# EAGLE board Simple_Motherboard (EAGLE 6.5.0)
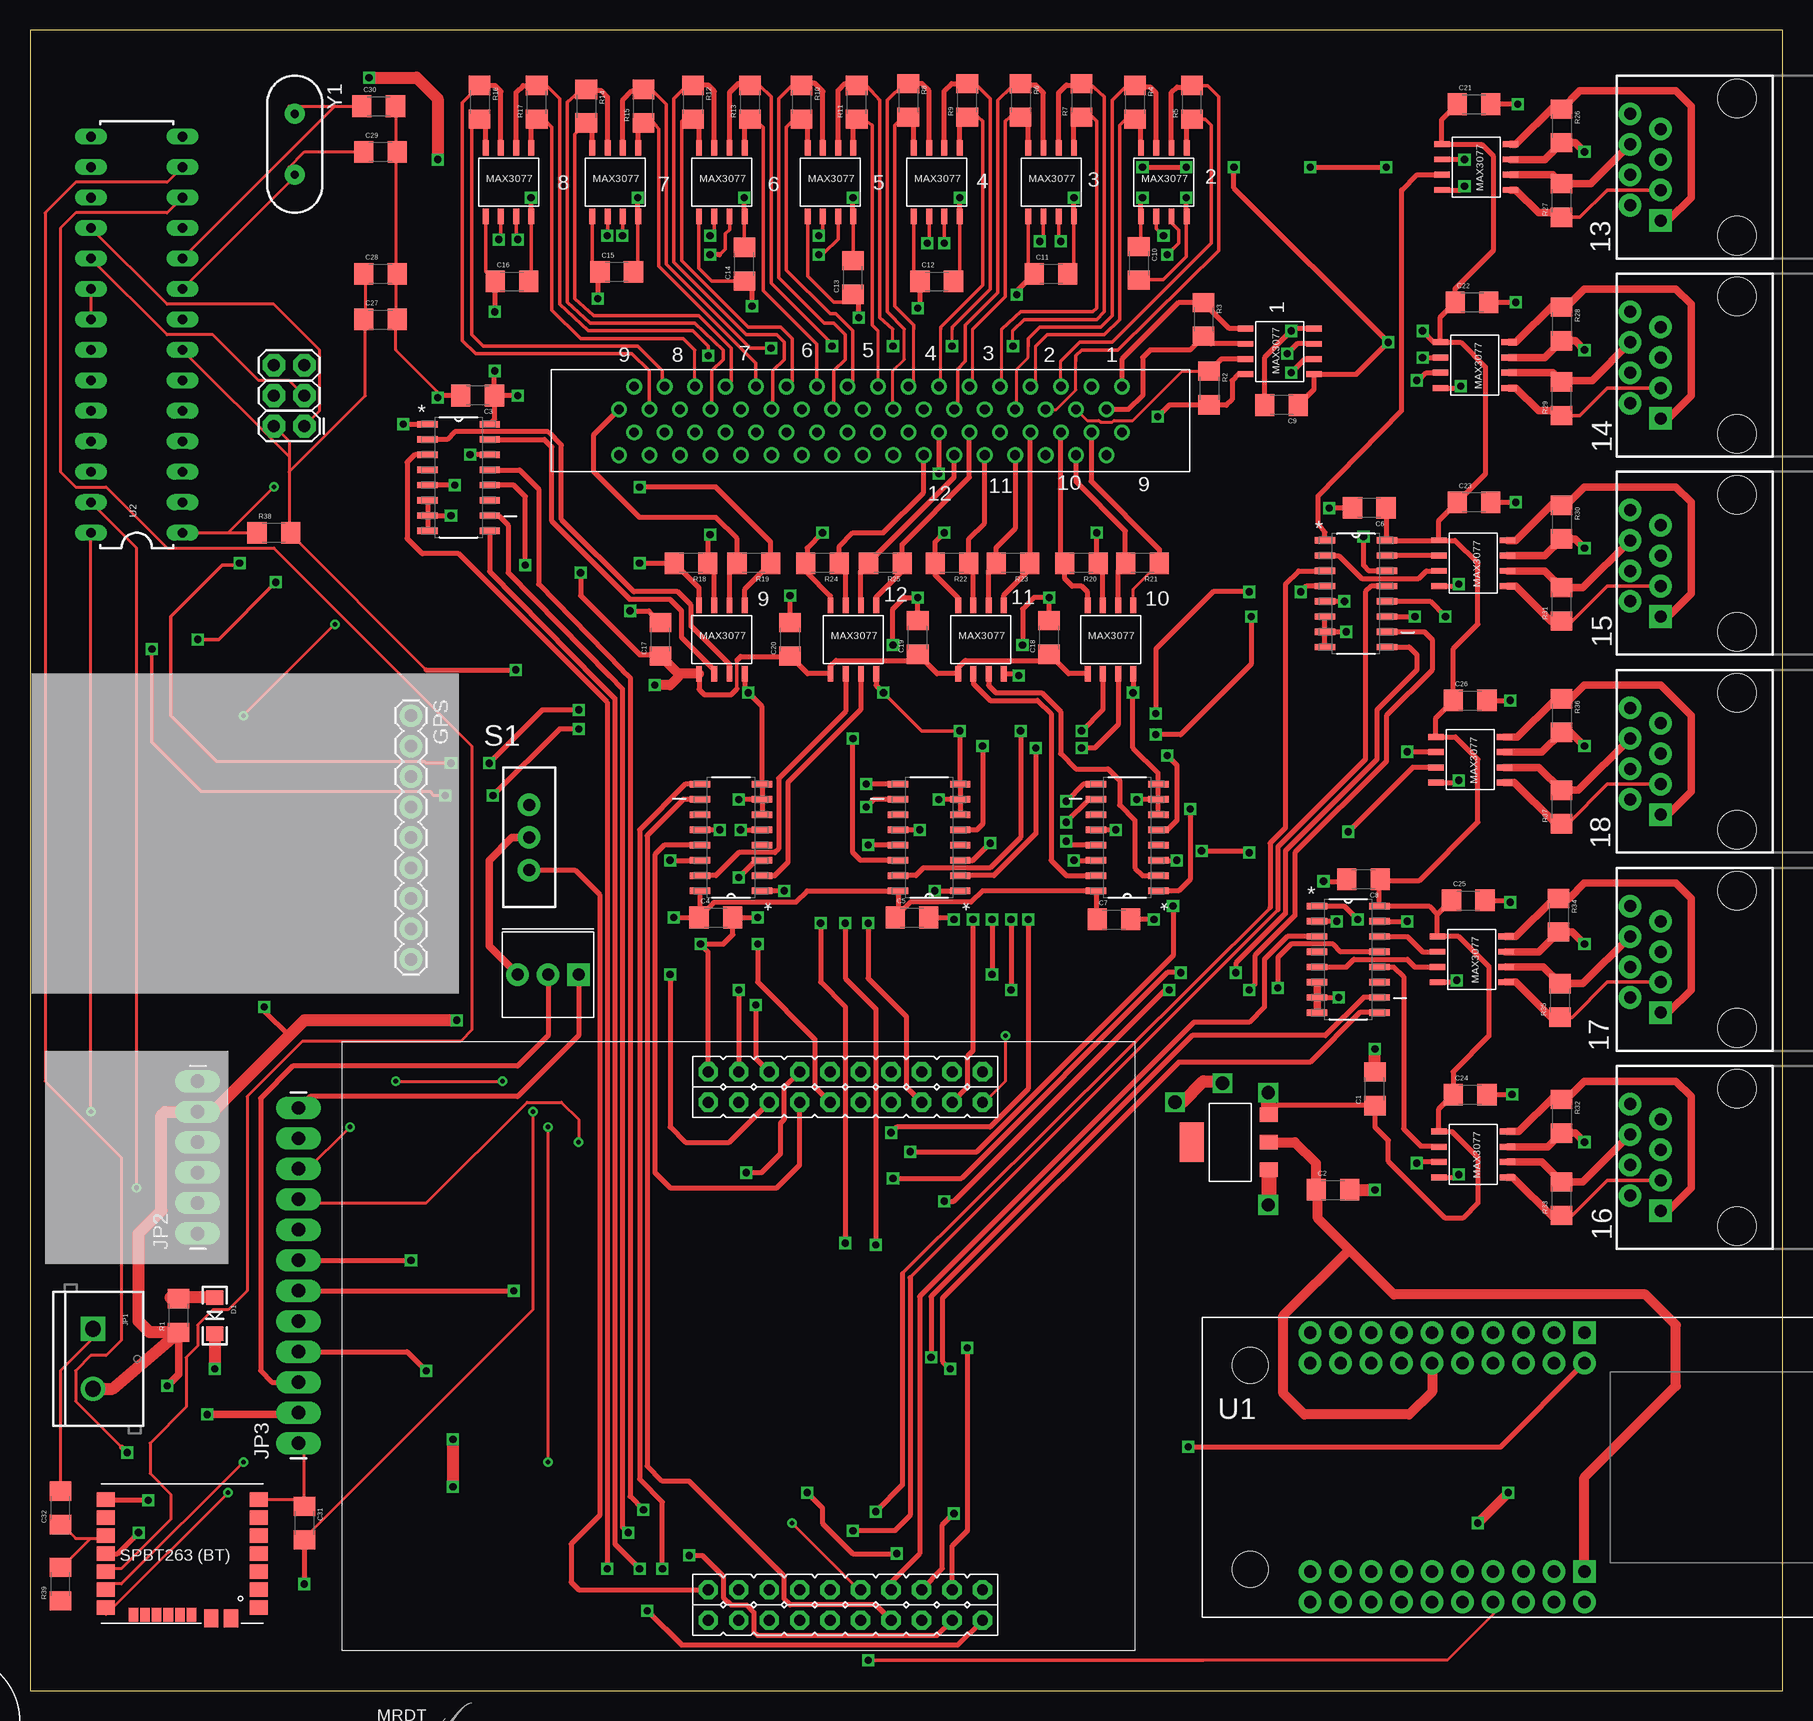
[diagram p7: board, top side]
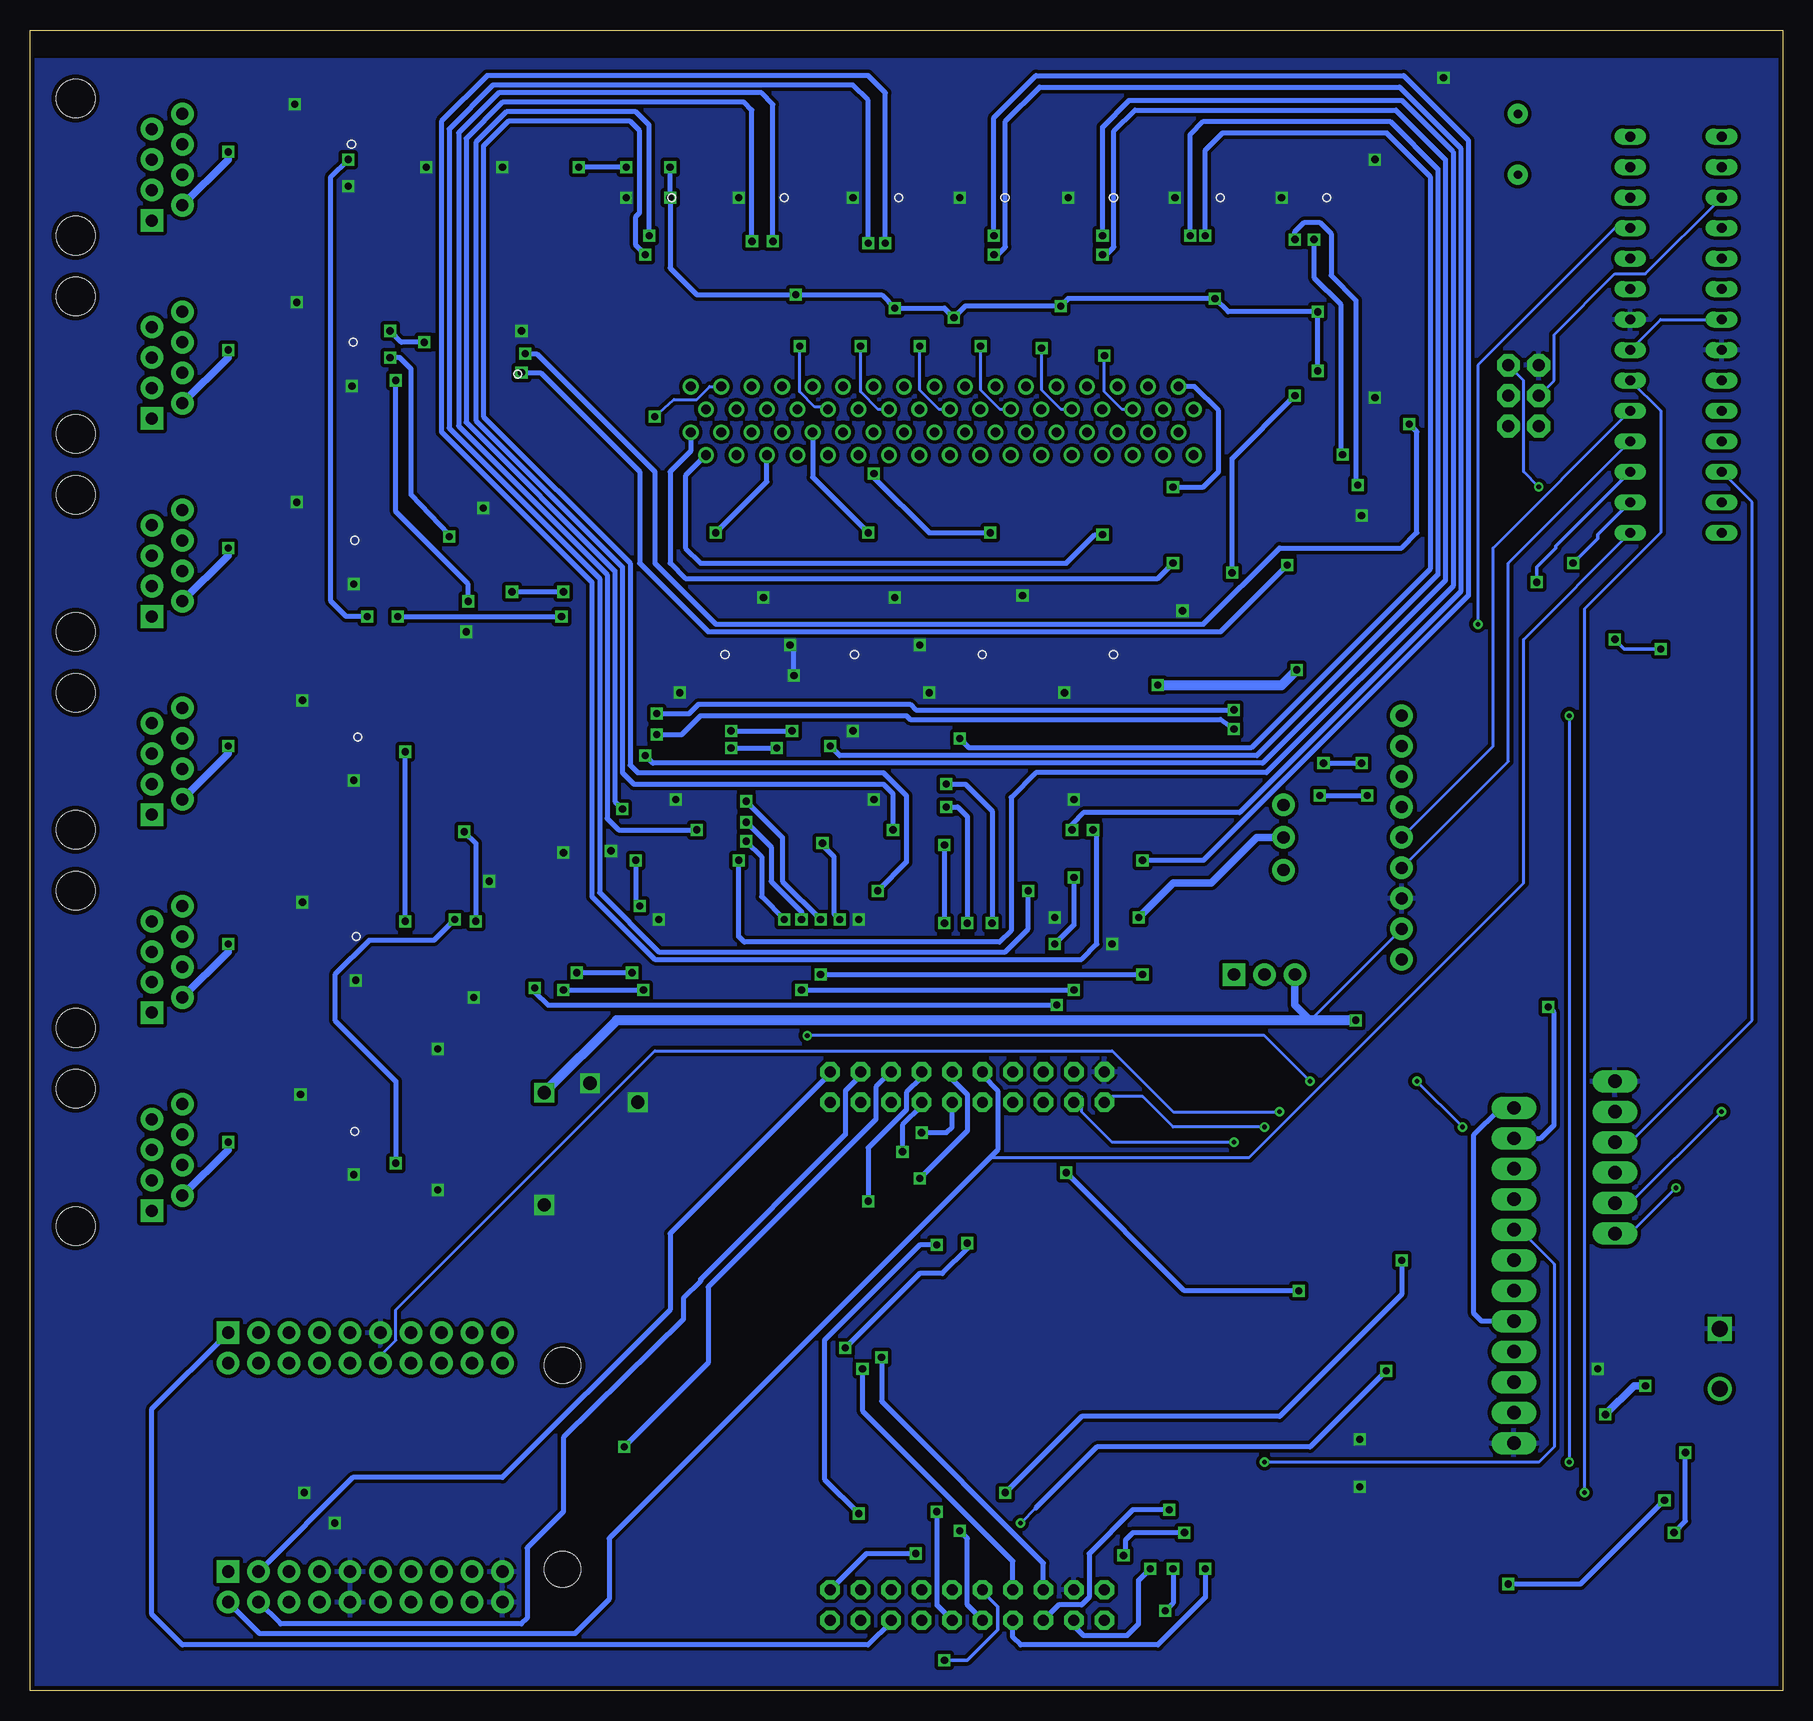
[diagram p8: board, bottom side, seen from below]

Size 146.05 x 138.43 mm. Coordinates in mm from the lower left corner, seen from the top.
Outline: 0,0 146.05,0 146.05,138.43 0,138.43 0,0
Copper layers (1*16): Top 0.035559375mm / dielectric 1.501140625mm / Bottom 0.035559375mm
Design rules "default *": minimum track width 10mil, minimum drill 15mil, track to track 8mil, track to pad 6mil, pad to pad 6mil, via to via 6mil, smd to smd 6mil, copper to edge 15mil, drill to drill 8mil, minimum pad ring 10mil, minimum via ring 8mil, stop-mask expansion 4mil, vias tented up to drill 0mil, thermal gap 10mil
tRestrict: area 26.4,21.6 to 33.8,21.6

## Footprints (pad centres in the part's own frame; a part is rotated, then mirrored left to right if it is on the bottom)
SPBT2632C2A = smd 1.2 x 1.5: BOOT 3,6.37; CTS 0,6.37; GND 4.5,-6.37; GPIO1 -4.5,-6.37; GPIO2 -3,-6.37; GPIO3 -1.5,-6.37; GPIO4 0,-6.37; GPIO5 1.5,-6.37; GPIO6 3,-6.37; RESET 1.5,6.37; RTS -1.5,6.37; RXD -3,6.37; TXD -4.5,6.37; VIN 4.5,6.37 | smd 1.5 x 1.2: GPIO7 -5.4,-4.05; LPO -5.4,-2.4 | smd 1.2 x 0.8: NC -5.1,4.075; NC1 -5.1,3.11; NC2 -5.1,2.145; NC3 -5.1,1.18; NC4 -5.1,0.215; NC5 -5.1,-0.75
1206 = smd 1.6 x 1.8: 1 -1.4,0; 2 1.4,0
LED-1206 = smd 1.2 x 1.4: A -1.5,0; C 1.5,0
1X09 = drill 1.016 pad 1.88: 1 0,0; 2 2.54,0; 3 5.08,0; 4 7.62,0; 5 10.16,0; 6 12.7,0; 7 15.24,0; 8 17.78,0; 9 20.32,0
H_MNTHOLE_#4 = drill 2.946: 1 0,0
2X3 = drill 1.016 pad 1.88 octagon: 1 0,0; 2 0,2.54; 3 2.54,0; 4 2.54,2.54; 5 5.08,0; 6 5.08,2.54
SCREWTERMINAL-5MM-2 = drill 1.3 pad 2.032 square: 1 0,0 | drill 1.3 pad 2.032: 2 5,0
1X06_LONGPADS = drill 1.118 pad 1.88 long: 1 0,0; 2 2.54,0; 3 5.08,0; 4 7.62,0; 5 10.16,0; 6 12.7,0
1X12_LONGPADS = drill 1.118 pad 1.88 long: 1 0,0; 2 2.54,0; 3 5.08,0; 4 7.62,0; 5 10.16,0; 6 12.7,0; 7 15.24,0; 8 17.78,0; 9 20.32,0; 10 22.86,0; 11 25.4,0; 12 27.94,0
MAX3070E = smd 0.49 x 1.3: A -1.905,2.857; B -0.635,2.857; DI 0.635,-2.857; GND 1.905,-2.857; RO -0.635,-2.857; VCC -1.905,-2.857; Y 1.905,2.857; Z 0.635,2.857
SWITCH-SPDT_LOCK.007S = drill 1.016 pad 1.88: 1 0,2.718; 2 0,0; 3 0,-2.718
WIZ811MJ = drill 1.02 pad 1.88 square: 1 0,0; 21 0,-19.92 | drill 1.02 pad 1.88: 2 0,-2.54; 3 -2.54,0; 4 -2.54,-2.54; 5 -5.08,0; 6 -5.08,-2.54; 7 -7.62,0; 8 -7.62,-2.54; 9 -10.16,0; 10 -10.16,-2.54; 11 -12.7,0; 12 -12.7,-2.54; 13 -15.24,0; 14 -15.24,-2.54; 15 -17.78,0; 16 -17.78,-2.54; 17 -20.32,0; 18 -20.32,-2.54; 19 -22.86,0; 20 -22.86,-2.54; 22 0,-22.46; 23 -2.54,-19.92; 24 -2.54,-22.46; 25 -5.08,-19.92; 26 -5.08,-22.46; 27 -7.62,-19.92; 28 -7.62,-22.46; 29 -10.16,-19.92; 30 -10.16,-22.46; 31 -12.7,-19.92; 32 -12.7,-22.46; 33 -15.24,-19.92; 34 -15.24,-22.46; 35 -17.78,-19.92; 36 -17.78,-22.46; 37 -20.32,-19.92; 38 -20.32,-22.46; 39 -22.86,-19.92; 40 -22.86,-22.46 | hole 3: -27.86,-19.73; -27.86,-2.73
SOIC127P600X175-16N = smd 1.702 x 0.533: 1 -2.591,4.445; 2 -2.591,3.175; 3 -2.591,1.905; 4 -2.591,0.635; 5 -2.591,-0.635; 6 -2.591,-1.905; 7 -2.591,-3.175; 8 -2.591,-4.445; 9 2.591,-4.445; 10 2.591,-3.175; 11 2.591,-1.905; 12 2.591,-0.635; 13 2.591,0.635; 14 2.591,1.905; 15 2.591,3.175; 16 2.591,4.445
DIL28-3 = drill 0.813 long: 1 -16.51,-3.81; 2 -13.97,-3.81; 3 -11.43,-3.81; 4 -8.89,-3.81; 5 -6.35,-3.81; 6 -3.81,-3.81; 7 -1.27,-3.81; 8 1.27,-3.81; 9 3.81,-3.81; 10 6.35,-3.81; 11 8.89,-3.81; 12 11.43,-3.81; 13 13.97,-3.81; 14 16.51,-3.81; 15 16.51,3.81; 16 13.97,3.81; 17 11.43,3.81; 18 8.89,3.81; 19 6.35,3.81; 20 3.81,3.81; 21 1.27,3.81; 22 -1.27,3.81; 23 -3.81,3.81; 24 -6.35,3.81; 25 -8.89,3.81; 26 -11.43,3.81; 27 -13.97,3.81; 28 -16.51,3.81
LD1117SOT-223 = smd 3.3 x 2: (VOUT) 0,3.2 | smd 1.2 x 1.5: GND -2.3,-3.2; VIN 2.3,-3.2; VOUT 0,-3.2
LAUNCHPAD-XL = drill 0.914 pad 1.6 octagon: 3.3V 30.48,2.54; GND1 33.02,5.08; GND2 30.48,48.26; PA2 53.34,48.26; PA3 50.8,48.26; PA4 48.26,48.26; PA5 48.26,2.54; PA6 50.8,2.54; PA7 53.34,2.54; PB0 35.56,2.54; PB1 38.1,2.54; PB2 33.02,48.26; PB3 35.56,45.72; PB4 45.72,2.54; PB5 33.02,2.54; PB6 45.72,48.26; PB7 43.18,48.26; PC4 38.1,45.72; PC5 40.64,45.72; PC6 43.18,45.72; PC7 45.72,45.72; PD0 35.56,5.08; PD1 38.1,5.08; PD2 40.64,5.08; PD3 43.18,5.08; PD6 48.26,45.72; PD7 50.8,45.72; PE0 35.56,48.26; PE1 45.72,5.08; PE2 48.26,5.08; PE3 50.8,5.08; PE4 40.64,2.54; PE5 43.18,2.54; PF0 38.1,48.26; PF1 53.34,5.08; PF2 30.48,45.72; PF3 33.02,45.72; PF4 53.34,45.72; RST 40.64,48.26; VBUS 30.48,5.08
60050685100 = drill 0.8: 1 47.555,7.107; 2 46.285,5.202; 3 45.015,7.107; 4 43.745,5.202; 5 42.475,7.107; 6 41.205,5.202; 7 39.935,7.107; 8 38.665,5.202; 9 37.395,7.107; 10 36.125,5.202; 11 34.855,7.107; 12 33.585,5.202; 13 32.315,7.107; 14 31.045,5.202; 15 29.775,7.107; 16 28.505,5.202; 17 27.235,7.107; 18 25.965,5.202; 19 24.695,7.107; 20 23.425,5.202; 21 22.155,7.107; 22 20.885,5.202; 23 19.615,7.107; 24 18.345,5.202; 25 17.075,7.107; 26 15.805,5.202; 27 14.535,7.107; 28 13.265,5.202; 29 11.995,7.107; 30 10.725,5.202; 31 9.455,7.107; 32 8.185,5.202; 33 6.915,7.107; 34 5.645,5.202; 35 47.555,3.297; 36 46.285,1.393; 37 45.015,3.297; 38 43.745,1.393; 39 42.475,3.297; 40 41.205,1.393; 41 39.935,3.297; 42 38.665,1.393; 43 37.395,3.297; 44 36.125,1.393; 45 34.855,3.297; 46 33.585,1.393; 47 32.315,3.297; 48 31.045,1.393; 49 29.775,3.297; 50 28.505,1.393; 51 27.235,3.297; 52 25.965,1.393; 53 24.695,3.297; 54 23.425,1.393; 55 22.155,3.297; 56 20.885,1.393; 57 19.615,3.297; 58 18.345,1.393; 59 17.075,3.297; 60 15.805,1.393; 61 14.535,3.297; 62 13.265,1.393; 63 11.995,3.297; 64 10.725,1.393; 65 9.455,3.297; 66 8.185,1.393; 67 6.915,3.297; 68 5.645,1.393
RJ45-8 = drill 1 pad 1.88 square: 1 -4.445,6.35 | drill 1 pad 1.88: 2 -3.175,8.89; 3 -1.905,6.35; 4 -0.635,8.89; 5 0.635,6.35; 6 1.905,8.89; 7 3.175,6.35; 8 4.445,8.89 | hole 3.2: -5.715,0; 5.715,0
3362U = drill 1.016 pad 1.88 square: P$1 0,2.54 | drill 1.016 pad 1.88: P$2 2.54,2.54; P$3 5.08,2.54
HC49US = drill 0.7 pad 1.651: 1 -2.54,0; 2 2.54,0

## Placement (x,y rotation side)
BLUETOOTH  SPBT2632C2A  [SPBT2632C2A]  12.7,11.43 90 top
C1  100nF  [1206]  112.08,50.16 90 top
C2  10uF  [1206]  108.59,41.75 0 top
C3  0.1uF  [1206]  37.31,107.95 180 top
C4  0.1uF  [1206]  57.15,64.45 0 top
C5  0.1uF  [1206]  73.5,64.45 0 top
C6  0.1uF  [1206]  111.6,98.58 180 top
C7  0.1uF  [1206]  90.33,64.29 0 top
C8  0.1uF  [1206]  111.12,67.63 180 top
C9  0.1uF  [1206]  104.3,107.16 180 top
C10  0.1uF  [1206]  92.39,118.97 270 top
C11  0.1uF  [1206]  85.09,118.11 0 top
C12  0.1uF  [1206]  75.56,117.48 0 top
C13  0.1uF  [1206]  68.58,117.79 90 top
C14  0.1uF  [1206]  59.53,118.9 90 top
C15  0.1uF  [1206]  48.89,118.27 0 top
C16  0.1uF  [1206]  40.16,117.48 0 top
C17  0.1uF  [1206]  52.55,87.63 90 top
C18  0.1uF  [1206]  84.93,87.79 90 top
C19  0.1uF  [1206]  73.98,87.79 90 top
C20  0.1uF  [1206]  63.34,87.63 90 top
C21  0.1uF  [1206]  120.33,132.24 0 top
C22  0.1uF  [1206]  120.17,115.73 0 top
C23  0.1uF  [1206]  120.33,99.06 0 top
C24  0.1uF  [1206]  120.01,49.69 0 top
C25  0.1uF  [1206]  119.86,65.88 0 top
C26  0.1uF  [1206]  120.01,82.55 0 top
C27  0.1uF  [1206]  29.21,114.3 0 top
C28  0.1uF  [1206]  29.21,118.11 0 top
C29  22pF  [1206]  29.21,128.27 0 top
C30  22pF  [1206]  29.05,132.08 0 top
C31  0.1uF  [1206]  22.86,13.97 270 top
C32  0.1uF  [1206]  2.54,15.24 90 top
D1  GREEN  [LED-1206]  15.4,31.27 270 top
GPS  M09  [1X09]  31.75,81.28 270 top
H1  [H_MNTHOLE_#4]  -6.35,-2.54 0 top  (outside the outline)
H2  [H_MNTHOLE_#4]  -17.78,-2.54 0 top  (outside the outline)
H3  [H_MNTHOLE_#4]  -29.21,-2.54 0 top  (outside the outline)
H4  [H_MNTHOLE_#4]  -40.64,-2.54 0 top  (outside the outline)
J1  AVR_SPI_PRG_6PTH  [2X3]  22.86,105.41 90 top
JP1  M025MM  [SCREWTERMINAL-5MM-2]  5.24,30.16 270 top
JP2  [1X06_LONGPADS]  13.97,38.1 90 top
JP3  M12LONGPADS  [1X12_LONGPADS]  22.38,20.64 90 top
R1  330  [1206]  12.38,31.27 90 top
R2  120  [1206]  98.27,108.59 270 top
R3  120  [1206]  97.79,114.3 270 top
R4  120  [1206]  92.07,132.4 270 top
R5  120  [1206]  96.84,132.4 90 top
R6  120  [1206]  82.55,132.56 270 top
R7  120  [1206]  87.63,132.56 90 top
R8  120  [1206]  73.18,132.56 270 top
R9  120  [1206]  78.1,132.56 90 top
R10  120  [1206]  64.29,132.4 270 top
R11  120  [1206]  68.9,132.4 90 top
R12  120  [1206]  55.24,132.4 270 top
R13  120  [1206]  60.01,132.4 90 top
R14  120  [1206]  46.35,132.08 270 top
R15  120  [1206]  51.12,132.08 90 top
R16  120  [1206]  37.46,132.4 270 top
R17  120  [1206]  42.23,132.4 90 top
R18  120  [1206]  55.09,93.98 180 top
R19  120  [1206]  60.32,93.98 180 top
R20  120  [1206]  87.63,93.98 180 top
R21  120  [1206]  92.71,93.98 180 top
R22  120  [1206]  76.84,93.98 180 top
R23  120  [1206]  81.91,93.98 180 top
R24  120  [1206]  66.04,93.98 180 top
R25  120  [1206]  71.28,93.98 180 top
R26  120  [1206]  127.63,130.43 270 top
R27  120  [1206]  127.63,124.21 90 top
R28  120  [1206]  127.63,113.92 270 top
R29  120  [1206]  127.63,107.7 90 top
R30  120  [1206]  127.63,97.41 270 top
R31  120  [1206]  127.63,90.55 90 top
R32  120  [1206]  127.63,47.88 270 top
R33  120  [1206]  127.63,41.02 90 top
R34  120  [1206]  127.38,64.64 270 top
R35  120  [1206]  127.51,57.53 90 top
R36  120  [1206]  127.63,81.28 270 top
R37  120  [1206]  127.63,73.66 90 top
R38  10k  [1206]  20.32,96.52 0 top
R39  10k  [1206]  2.54,8.89 90 top
RS-485-1  MAX3077  [MAX3070E]  120.52,127 270 top
RS-485-2  MAX3077  [MAX3070E]  120.4,110.49 270 top
RS-485-3  MAX3077  [MAX3070E]  120.27,93.98 270 top
RS-485-4  MAX3077  [MAX3070E]  120.27,44.7 270 top
RS-485-5  MAX3077  [MAX3070E]  120.14,60.96 270 top
RS-485-6  MAX3077  [MAX3070E]  120.01,77.6 270 top
RS_TRANS_1  MAX3077  [MAX3070E]  104.14,111.63 90 top
RS_TRANS_2  MAX3077  [MAX3070E]  94.49,125.73 0 top
RS_TRANS_3  MAX3077  [MAX3070E]  85.09,125.73 0 top
RS_TRANS_4  MAX3077  [MAX3070E]  75.56,125.73 0 top
RS_TRANS_5  MAX3077  [MAX3070E]  66.71,125.73 0 top
RS_TRANS_6  MAX3077  [MAX3070E]  57.66,125.73 0 top
RS_TRANS_7  MAX3077  [MAX3070E]  48.77,125.73 0 top
RS_TRANS_8  MAX3077  [MAX3070E]  39.88,125.73 0 top
RS_TRANS_9  MAX3077  [MAX3070E]  57.66,87.63 0 top
RS_TRANS_10  MAX3077  [MAX3070E]  90.04,87.63 0 top
RS_TRANS_11  MAX3077  [MAX3070E]  79.25,87.63 0 top
RS_TRANS_12  MAX3077  [MAX3070E]  68.61,87.63 0 top
S1  [SWITCH-SPDT_LOCK.007S]  41.59,71.12 0 top
U1  WIZ811MJ  [WIZ811MJ]  129.54,29.84 0 top
U1_MUX  74HC4052D,653  [SOIC127P600X175-16N]  35.72,101.12 0 top
U2  ATMEGA328P_PDIP  [DIL28-3]  8.89,113.03 90 top
U2_MUX  74HC4052D,653  [SOIC127P600X175-16N]  74.93,71.12 180 top
U3_MUX  74HC4052D,653  [SOIC127P600X175-16N]  91.44,71.12 180 top
U4_MUX  74HC4052D,653  [SOIC127P600X175-16N]  58.42,71.12 180 top
U5_MUX  74HC4052D,653  [SOIC127P600X175-16N]  110.49,91.44 0 top
U7_MUX  74HC4052D,653  [SOIC127P600X175-16N]  109.85,60.96 0 top
U$1  LD1117  [LD1117SOT-223]  100.01,45.72 90 top
U$2  STELLARIS-LAUNCHPADSTELLARIS-LAUNCHPAD-XL  [LAUNCHPAD-XL]  26.04,3.33 0 top
U$3  TB60050685100  [60050685100]  43.43,101.6 0 top
U$4  RJ45-8PTH  [RJ45-8]  142.24,127 90 top
U$5  RJ45-8PTH  [RJ45-8]  142.24,110.49 90 top
U$6  RJ45-8PTH  [RJ45-8]  142.24,93.98 90 top
U$7  RJ45-8PTH  [RJ45-8]  142.24,44.45 90 top
U$8  RJ45-8PTH  [RJ45-8]  142.24,60.96 90 top
U$9  RJ45-8PTH  [RJ45-8]  142.24,77.47 90 top
U$10  10k  [3362U]  45.72,62.23 180 top
Y1  16MHz  [HC49US]  22.07,128.91 270 top

## Tracks (layer width: path | path; a pad name or v marks a point on that pad's centre or on a via)
1_RX+  (via drill 0.6)
  Top 0.254: R2.2 97.5,107.47
  Top 0.406: RS_TRANS_1.A 100.68,109.73 100.17,109.22 100.17,107.63 99.69,107.16 98.29,107.16 R2.2 94.96,107.19 v93.98,106.2
  Bottom 0.254: v93.98,106.2 92.39,107.63 90.49,107.63 89.41,108.71 U$3.3
1_RX-
  Top 0.254: U$3.4 88.09,105.89 89.06,105.89 89.22,105.73 90.17,105.73 90.33,105.89 91.92,105.89 96.01,109.98 R2.1
  Top 0.406: RS_TRANS_1.B 99.28,111 R2.1
1_TX+
  Top 0.406: RS_TRANS_1.Y 99.95,113.54 R3.1 95.7,115.7 90.99,110.99 U$3.1
1_TX-
  Top 0.406: RS_TRANS_1.Z 98.42,112.27 R3.2 96.65,111.76 93.34,111.76 92.71,111.12 92.71,107.95 91.53,106.8 U$3.2
2_RX+
  Top 0.254: U$3.7 83.82,109.16 83.82,112.08
  Top 0.305: 83.82,112.08 84.77,113.03 89.53,113.03 90.81,114.3 90.81,130.49 91.31,131 R4.2
  Top 0.406: RS_TRANS_2.A 92.58,130.49 R4.2
2_RX-
  Top 0.254: U$3.8 82.23,106.94 82.23,110.17 83.19,111.12 83.19,112.08
  Top 0.305: 83.19,112.08 83.19,112.71 84.14,113.67 89.22,113.67 90.17,114.62 90.17,132.56 91.41,133.8 R4.1
  Top 0.406: RS_TRANS_2.B 93.85,133.16 93.34,133.67 92.21,133.67 R4.1
2_TX+
  Top 0.254: U$3.5 85.88,108.73 85.88,110.81
  Top 0.305: 85.88,110.81 87.47,112.4 90.17,112.4 98.43,120.65 98.43,130.49 97.92,131 R5.1
  Top 0.406: RS_TRANS_2.Y 96.39,130.55 R5.1
2_TX-
  Top 0.254: U$3.6 85.53,106.8 87.15,108.43 87.15,110.81
  Top 0.305: 87.15,110.81 87.15,111.28 87.63,111.76 90.65,111.76 99.06,120.02 99.06,132.87 98.14,133.8 R5.2
  Top 0.406: RS_TRANS_2.Z 95.12,133.22 95.57,133.67 96.71,133.67 R5.2
3_RX+
  Top 0.254: U$3.11 78.58,109.05 78.58,113.51
  Top 0.305: 78.58,113.51 81.28,116.21 81.28,130.81 81.63,131.16 R6.2
  Top 0.406: RS_TRANS_3.A 83.19,130.52 R6.2
3_RX-
  Top 0.254: U$3.12 77.31,107.15
  Top 0.305: 77.31,107.15 77.31,110.17 77.95,110.81 77.95,113.82 80.64,116.52 80.64,132.56 81.76,133.67 82.26,133.67 R6.1
  Top 0.406: R6.1 82.68,133.83 83.82,133.83 84.45,133.19 RS_TRANS_3.B
3_TX+
  Top 0.254: U$3.9 80.96,108.84 80.96,113.51
  Top 0.305: 80.96,113.51 82.55,114.94 88.58,114.94 88.9,115.25 88.9,130.81 88.55,131.16 R7.1
  Top 0.406: RS_TRANS_3.Y 87,130.52 R7.1
3_TX-  (via drill 0.6)
  Top 0.254: 87.76,133.83 R7.2 | v81.91,112.08 81.91,113.35
  Top 0.305: 81.91,113.35 82.87,114.3 88.9,114.3 89.53,114.94 89.53,132.87 88.29,133.96 R7.2
  Top 0.406: RS_TRANS_3.Z 85.72,133.19 86.36,133.83 87.5,133.83 R7.2
  Bottom 0.254: U$3.10 79.75,107 80.64,107 81.91,108.27 v81.91,112.08
4_RX+
  Top 0.254: U$3.15 73.66,109.16 73.66,113.51
  Top 0.305: 73.66,113.51 73.66,113.82 72.07,115.41 72.07,130.49 72.39,130.81 72.84,130.81 R8.2
  Top 0.406: RS_TRANS_4.A 73.66,130.68 R8.2
4_RX-
  Top 0.254: U$3.16 71.91,106.83 71.91,110.01 72.87,110.97 72.87,113.51
  Top 0.305: 72.87,113.51 71.44,114.94 71.44,132.56 72.84,133.96 R8.1
  Top 0.406: RS_TRANS_4.B 74.93,133.35 74.32,133.96 R8.1
4_TX+
  Top 0.254: U$3.13 75.88,108.84 75.88,113.51
  Top 0.305: 75.88,113.51 75.88,113.67 79.38,117.16 79.38,130.81 79.03,131.16 R9.1
  Top 0.406: RS_TRANS_4.Y 77.47,130.52 R9.1
4_TX-  (via drill 0.6)
  Top 0.254: v76.84,112.08 76.84,113.51
  Top 0.305: 76.84,113.51 76.84,113.67 80.01,116.84 80.01,132.72 78.77,133.96 R9.2
  Top 0.406: RS_TRANS_4.Z 76.2,133.35 76.81,133.96 R9.2
  Bottom 0.254: U$3.14 75.37,106.8 76.84,108.27 v76.84,112.08
5_RX+
  Top 0.305: U$3.19 68.58,109.16 68.58,113.35 67.15,114.78 66.67,114.78 63.02,118.43 63.02,130.33 63.69,131 R10.2
  Top 0.406: RS_TRANS_5.A 64.8,130.49 R10.2
5_RX-
  Top 0.305: U$3.20 66.99,106.94 66.99,110.01 67.94,110.97 67.94,113.03 66.99,113.98 66.2,113.98 62.39,117.79 62.39,132.72 63.47,133.8 R10.1
  Top 0.406: RS_TRANS_5.B 66.07,133.32 65.41,133.98 64.48,133.98 R10.1 64.74,133.35
5_TX+
  Top 0.254: U$3.17 70.67,113.32 70.64,113.35
  Top 0.305: 70.64,113.35 70.17,113.82 70.17,130.49 69.69,130.81 69.09,130.81 R11.1
  Top 0.406: RS_TRANS_5.Y 68.61,130.71 R11.1
5_TX-  (via drill 0.6)
  Top 0.254: v71.91,112.08 71.91,113.51
  Top 0.305: 71.91,113.51 70.8,114.46 70.8,132.56 69.72,133.8 R11.2
  Top 0.406: RS_TRANS_5.Z 67.34,133.38 67.94,133.98 68.71,133.98 R11.2
  Bottom 0.254: U$3.18 70.29,106.8 71.91,108.43 v71.91,112.08
6_RX+
  Top 0.254: U$3.23 63.5,109.16
  Top 0.305: 63.5,109.16 63.5,112.71 62.55,113.67 59.85,113.67 54.29,119.22 54.29,130.81 54.48,131 R12.2
  Top 0.406: RS_TRANS_6.A 55.75,130.49 R12.2
6_RX-
  Top 0.254: U$3.24 61.91,106.94
  Top 0.305: 61.91,106.94 61.91,110.01 62.87,110.97 62.87,112.4 62.23,113.03 59.69,113.03 53.66,119.06 53.66,132.72 54.74,133.8 R12.1
  Top 0.406: RS_TRANS_6.B 57.02,133.32 56.52,133.83 55.27,133.83 R12.1
6_TX+
  Top 0.305: R13.1 60.3,131 61.12,130.33 61.12,116.68 65.56,112.24 65.56,108.73 U$3.21
  Top 0.406: RS_TRANS_6.Y 59.56,130.55 R13.1
6_TX-  (via drill 0.6)
  Top 0.305: R13.2 60.83,133.8 61.75,132.87 61.75,117.32 66.83,112.24 v66.83,112.08
  Top 0.406: RS_TRANS_6.Z 58.29,133.22 59.05,133.98 59.82,133.98 R13.2
  Bottom 0.254: U$3.22 65.21,106.8 66.83,108.43 v66.83,112.08
7_RX+
  Top 0.254: U$3.27 58.42,109.16
  Top 0.305: 58.42,109.16 58.42,111.92 55.72,114.62 46.99,114.62 45.4,116.05 45.4,129.73 R14.2
  Top 0.406: RS_TRANS_7.A 46.86,130.17 R14.2
7_RX-
  Top 0.254: U$3.28 56.83,106.94
  Top 0.305: 56.83,106.94 56.83,110.01 57.78,110.97 57.78,111.76 55.4,113.98 46.67,113.98 44.77,115.73 44.77,132.4 46.01,133.48 R14.1
  Top 0.406: RS_TRANS_7.B 48.13,132.84 47.62,133.35 46.48,133.35 R14.1
7_TX+
  Top 0.305: R15.1 52.04,130.68 52.39,130.18 52.39,118.75 60.48,110.65 60.48,108.73 U$3.25
  Top 0.406: RS_TRANS_7.Y 50.67,130.23 R15.1
7_TX-  (via drill 0.6)
  Top 0.305: R15.2 51.78,133.48 53.02,132.24 53.02,118.9 60.01,111.92 v61.75,111.92
  Top 0.406: RS_TRANS_7.Z 49.4,132.59 50.16,133.35 50.99,133.35 R15.2
  Bottom 0.254: U$3.26 60.13,106.8 61.75,108.43 v61.75,111.92
8_RX+
  Top 0.305: U$3.31 52.7,108.89 52.7,110.01 50.64,112.08 37.78,112.08 36.83,113.03 36.83,130.36 R16.2
  Top 0.406: RS_TRANS_8.A 37.97,130.49 R16.2
8_RX-
  Top 0.254: U$3.32 51.59,106.83
  Top 0.305: 51.59,106.83 51.59,110.01 50.16,111.44 37.15,111.44 36.04,112.55 36.04,132.37 R16.1
  Top 0.406: RS_TRANS_8.B 39.24,133.32 38.76,133.8 R16.1
8_TX+
  Top 0.254: U$3.29 55.4,108.73 55.4,111.76
  Top 0.305: 55.4,111.76 54.45,112.71 45.88,112.71 43.5,115.09 43.5,130.33 42.83,131 R17.1
  Top 0.406: RS_TRANS_8.Y 41.78,130.55 R17.1
8_TX-  (via drill 0.6)
  Top 0.305: v56.52,111.28 56.52,112.08 55.24,113.35 46.51,113.35 44.13,115.57 44.13,132.72 43.05,133.8 R17.2
  Top 0.406: RS_TRANS_8.Z 40.51,133.22 41.09,133.8 R17.2
  Bottom 0.254: U$3.30 55.05,106.8 56.52,108.27 v56.52,111.28
9_RX+  (via drill 0.6)
  Top 0.406: RS_TRANS_9.A 55.75,91.91 R18.2 v50.8,93.98
  Bottom 0.406: U$3.35 90.99,103.32 92.71,101.6 92.71,93.98 91.44,92.71 52.07,92.71 v50.8,93.98
9_RX-  (via drill 0.6)
  Top 0.406: RS_TRANS_9.B 57.02,93.44 R18.1 56.49,96.17 v56.67,96.36
  Bottom 0.406: U$3.36 91.44,101.27 91.44,95.25 90.17,93.98 59.69,93.98 57.31,96.36 v56.67,96.36
9_TX+  (via drill 0.6)
  Top 0.406: RS_TRANS_9.Y 59.56,91.82 R19.1 61.73,95.76 57.15,100.33 v50.8,100.33
  Bottom 0.406: v50.8,100.33 48.26,100.33 46.99,101.6 46.99,106.68 49.02,108.71 U$3.33
9_TX-
  Top 0.406: RS_TRANS_9.Z 58.29,93.35 R19.2 58.92,96.02 57.15,97.79 50.8,97.79 46.99,101.6 46.99,104.71 U$3.34
10_RX+
  Top 0.406: RS_TRANS_10.A 88.14,91.57 87.63,92.08 86.84,92.08 86.23,92.68 R20.2 85.91,94.3 U$3.39
10_RX-  (via drill 0.6)
  Top 0.406: RS_TRANS_10.B 89.41,93.6 R20.1 88.9,94.11 v88.9,96.52
  Bottom 0.406: v88.9,96.52 84.64,100.78 U$3.40
10_TX+
  Top 0.254: RS_TRANS_10.Y 91.95,91.82 R21.1
  Top 0.406: U$3.37 88.42,104.87 88.42,100.81 94.11,95.12 R21.1
10_TX-
  Top 0.406: RS_TRANS_10.Z 90.68,93.35 R21.2 91.28,94.01 91.28,96.68 87.18,100.78 U$3.38
11_RX+  (via drill 0.6)
  Top 0.406: RS_TRANS_11.A 77.34,91.09 75.44,93 R22.2 75.44,95.76 v76.2,96.52
  Bottom 0.406: v76.2,96.52 80.83,101.15 U$3.43
11_RX-
  Top 0.406: RS_TRANS_11.B 78.61,93.6 R22.1 78.23,96.02 79.56,97.34 U$3.44
11_TX+
  Top 0.406: RS_TRANS_11.Y 81.15,91.31 83.31,93.48 R23.1 83.37,94.03 U$3.41
11_TX-
  Top 0.406: RS_TRANS_11.Z 79.88,93.35 R23.2 80.52,95.28 82.1,96.86 U$3.42
12_RX+  (via drill 0.6)
  Top 0.406: RS_TRANS_12.A 66.71,91.25 64.77,93.19 64.77,93.85 R24.2 64.77,94.11 64.77,95.25 v66.04,96.52 | U$3.47 75.75,101.47 v75.72,101.44
  Bottom 0.406: v75.72,101.44 75.72,101.12 71.12,96.52 v66.04,96.52
12_RX-
  Top 0.406: RS_TRANS_12.B 67.98,93.44 R24.1 67.44,95.38 68.58,96.52 71.12,96.52 74.48,99.88 U$3.48
12_TX+
  Top 0.406: RS_TRANS_12.Y 70.52,91.15 72.68,93.32 R25.1 72.68,95.54 78.29,101.15 U$3.45
12_TX-
  Top 0.406: RS_TRANS_12.Z 69.25,93.35 R25.2 69.85,93.98 77.02,101.15 U$3.46
328_RX  (via drill 0.6)
  Top 0.305: v35.08,77.31 33.02,77.31 32.86,77.47 15.56,77.47 11.75,81.28 11.75,89.54 16.03,93.82 17.3,93.82 v17.46,93.98
  Top 0.406: U5_MUX.4 106.36,92.08 v105.89,91.6 | v101.6,91.6 98.58,91.6 93.82,86.84 v93.82,81.44 | v45.72,81.76 42.7,81.76 v38.26,77.31
  Bottom 0.305: v17.46,93.98 15.4,96.04 15.4,96.36 U2.2
  Bottom 0.406: v105.89,91.6 v101.6,91.6 | v93.82,81.44 91.12,81.44 90.33,82.23 72.71,82.23 72.23,81.76 v45.72,81.76 | v38.26,77.31 v35.08,77.31
328_TX  (via drill 0.6)
  Top 0.305: v34.61,74.61 33.66,74.61 33.34,74.93 14.29,74.93 10.16,79.06 v10.16,86.84 | v13.97,87.63 15.72,87.63 v20.48,92.39
  Top 0.406: U5_MUX.11 v115.41,89.54 | v101.76,89.54 101.76,85.57 95.88,79.69 v93.82,79.69 | v45.72,80.17 44.13,80.17 v38.58,74.61
  Bottom 0.305: v10.16,86.84 13.18,86.84 v13.97,87.63 | v20.48,92.39 20.48,93.66 18.89,95.25 18.89,95.41 U2.3
  Bottom 0.406: v115.41,89.54 v101.76,89.54 | v93.82,79.69 91.76,79.69 90.17,81.28 73.03,81.28 72.71,80.96 46.83,80.96 v45.72,80.17 | v38.58,74.61 v34.61,74.61
+3V3  (via drill 0.38, 0.6)
  Top 0.254: v41.91,48.26 41.91,31.75 22.86,12.7 C31.2
  Top 0.406: 106.68,42.26 C2.1 | 22.86,12.7 v22.86,8.89 | v9.84,15.88 6.38,15.88 BLUETOOTH.VIN
  Top 0.813: U1.21 129.54,17.78 137.16,25.4 137.16,30.48 134.62,33.02 113.66,33.02 109.93,36.75 | 109.93,36.75 107.31,39.37 107.31,41.62 C2.1 107.16,41.78 107.16,43.97 105.41,45.72 U$1.VOUT | U1.12 116.84,24.92 114.94,23.02 106.2,23.02 104.46,24.77 104.46,31.27 109.93,36.75
  Bottom 0.254: v41.91,48.26 50.8,48.26 55.88,53.34 93.98,53.34 115.57,31.75 115.57,29.21 116.84,27.94 U1.12
  Bottom 0.406: v22.86,8.89 16.83,8.89 v9.84,15.88
+5V  (via drill 0.6, 1.1)
  Top 0.254: U2.20 U2.21 | 27.94,114.3 27.94,118.11 C28.1 | 21.59,102.87 21.59,104.14 J1.2 | 21.59,102.87 21.59,101.6 | 21.59,101.6 21.59,96.52 | 21.59,102.87 U2.7 | 27.94,114.3 27.94,107.95 21.59,101.6 | 27.94,114.3 C27.1 | 33.02,85.09 21.59,96.52 | 21.59,96.52 R38.2
  Top 0.305: RS_TRANS_8.VCC 37.97,118.27 C16.1 | C14.1 56.8,117.5 55.72,118.59 55.72,122.84 RS_TRANS_6.VCC | RS_TRANS_2.VCC 92.58,120.56 C10.1 | RS_TRANS_3.VCC 83.19,118.62 C11.1 | RS_TRANS_5.VCC 64.8,117.92 66.99,115.73 67.92,115.73 C13.1 | RS_TRANS_7.VCC 46.86,118.27 C15.1 | RS_TRANS_4.VCC 73.66,117.98 C12.1 | 58.9,83.5 58.9,85.88
  Top 0.406: RS-485-3.VCC 117.41,97.54 C23.1 121.28,101.41 121.28,110.33 119.22,112.4 RS-485-2.VCC | RS-485-2.VCC 117.54,114.49 C22.1 118.75,115.76 118.75,116.84 121.92,120.02 121.92,127.95 120.97,128.91 RS-485-1.VCC 117.67,130.97 C21.1 | 117.28,64.71 RS-485-5.VCC 119.06,62.87 121.6,60.32 121.6,54.61 118.59,51.59 118.59,49.72 C24.1 117.41,48.48 RS-485-4.VCC 118.49,46.61 120.65,44.45 120.65,40.64 119.38,39.37 117.95,39.37 113.19,44.13 113.19,45.88 112.08,46.99 C1.1 103.96,48.77 U$1.VIN 103.19,48.05 | 117.28,64.71 C25.1 | C9.1 107,108.46 RS_TRANS_1.VCC 110.52,109.73 v113.19,112.4 100.33,125.25 v100.33,127 | RS_TRANS_10.VCC 86.55,84.77 C18.1 84.43,85.88 77.95,85.88 77.34,85.28 RS_TRANS_11.VCC 75.59,84.77 C19.1 73.47,85.88 67.15,85.88 66.71,85.44 RS_TRANS_12.VCC 64.8,84.77 C20.1 63.31,86.2 59.21,86.2 58.9,85.88 | C16.1 38.73,117.48 v38.73,114.94 | C15.1 47.31,118.27 v47.31,116.05 | C14.1 60.17,117.5 v60.17,115.41 | v69.06,114.46 69.06,115.92 C13.1 | C12.1 74.16,115.44 v73.98,115.25 | v82.23,116.36 82.23,116.65 C11.1 | RS_TRANS_2.VCC 92.58,124.33 v92.71,124.46 | C3.1 38.71,105.97 U1_MUX.16 | C6.1 113.08,98.5 U5_MUX.16 RS-485-3.VCC | C7.1 88.85,64.37 U3_MUX.16 79.38,66.68 78.42,65.72 73.37,65.72 C5.1 72.34,64.69 U2_MUX.16 64.77,66.68 63.82,65.72 56.99,65.72 56.86,65.59 56.86,65.56 C4.1 | U4_MUX.16 55.83,64.53 C4.1 | 117.28,64.71 116.59,65.41 U7_MUX.16 112.45,67.55 113.03,67.55 | 113.03,67.55 115.81,67.55 120.65,72.39 120.65,77.63 118.78,79.5 RS-485-6.VCC 117.16,81.09 C26.1 118.62,86.87 120.65,88.9 120.65,93.98 118.75,95.89 RS-485-3.VCC | C3.1 38.71,109.98 v38.73,110.01
  Top 0.406: RS-485-2.VCC 117,112.4 v116.05,113.35 | v92.71,127 v96.36,127 | RS_TRANS_9.VCC 55.75,83.47 56.2,83.03 58.42,83.03 58.9,83.5 | v45.88,93.19 45.88,91.28 50.8,86.36 52.42,86.36 C17.1 | v40.64,107.95 C3.1 | v53.66,64.45 C4.1 | C8.1 112.95,67.63 113.03,67.55 | 54,84.77 54,84.48 | 33.02,85.09 v40.48,85.09 | v19.53,56.99 19.53,56.67 21.59,54.61
  Top 0.61: S1.2 40.16,71.12 38.26,69.22 38.26,62.07 U$10.P$3 | R1.1 12.38,26.35 v11.43,25.4 | v14.76,23.02 22.22,23.02 JP3.2
  Top 0.813: RS_TRANS_9.VCC 54,84.77 C17.1 | 54,84.48 53.34,83.82 v52.07,83.82
  Top 1.016: JP1.2 6.88,25.16 R1.1 9.97,29.87 9.05,30.8 9.05,38.1 10.95,40.01 10.95,47.94 11.27,48.26 JP2.5 15.24,48.26 21.59,54.61 22.86,55.88 v35.56,55.88
  Top 1.27: v103.19,49.85 103.19,48.05
  Bottom 0.254: U2.21 10.16,114.3 U2.7 | 39.37,55.88 GPS.8
  Bottom 0.406: v38.73,110.01 v38.73,114.94 46.2,114.94 v47.31,116.05 59.53,116.05 v60.17,115.41 68.1,115.41 v69.06,114.46 69.85,115.25 v73.98,115.25 75.09,116.36 v82.23,116.36 90.49,116.36 92.71,118.59 v92.71,124.46 v92.71,127 | v113.19,112.4 115.09,112.4 v116.05,113.35 | v96.36,127 v100.33,127 | v45.88,93.19 45.88,102.71 v40.64,107.95 | JP3.11 20.16,46.04 19.05,47.15 19.05,56.52 v19.53,56.99
  Bottom 0.61: v53.66,64.45 50.8,67.31 47.62,67.31 43.81,71.12 S1.2 | U$10.P$3 40.64,57.15 39.37,55.88 | v11.43,25.4 12.38,25.4 v14.76,23.02
  Bottom 0.813: v35.56,55.88 39.37,55.88 97.16,55.88 v103.19,49.85 | v52.07,83.82 41.75,83.82 v40.48,85.09
AT_MISO
  Top 0.254: U2.18 11.43,115.57 20.32,115.57 24.13,111.76 24.13,106.68 J1.1
AT_MOSI
  Bottom 0.254: U2.17 11.43,118.11 13.97,118.11 19.05,113.03 19.05,109.22 J1.4
AT_SCK
  Top 0.254: U2.19 11.43,113.03 15.24,113.03 19.05,109.22 21.59,109.22 J1.3
ATCLK3
  Top 0.254: 25.4,132.08 21.59,132.08 Y1.1 | 25.4,132.08 C30.1 27.94,132.08 | 25.4,132.08 U2.10
ATCLK4
  Top 0.254: 27.94,128.27 C29.1 22.86,128.27 21.59,127 Y1.2 21.59,125.73 U2.9
BLUETH_CTS  (via drill 0.6)
  Top 0.254: 7.62,20.32 3.81,24.13 3.81,26.67 5.08,27.94 6.35,27.94 7.62,29.21 7.62,44.45 1.27,50.8 1.27,123.19 3.81,125.73 11.43,125.73 U2.13
  Top 0.406: BLUETOOTH.CTS 7.3,11.43 v9.05,13.18 | v8.1,19.84 7.62,20.32
  Bottom 0.406: v9.05,13.18 8.1,14.13 v8.1,19.84
BLUETH_RTS
  Top 0.254: U2.12 11.43,123.19 3.81,123.19 2.54,121.92 2.54,101.6 3.81,100.33 6.35,100.33 11.43,95.25 20.32,95.25 36.83,78.74 36.83,55.09 35.88,54.13 22.7,54.13 18.1,49.53 18.1,33.34 16.51,31.75 15.24,31.75 13.97,30.48 13.97,28.73 13.02,27.78 13.02,23.65 10,20.64 10,18.1 11.75,16.35 11.75,14.29 7.62,10.16 6.35,10.16 BLUETOOTH.RTS
BLUETH_RXD  (via drill 0.38)
  Top 0.254: v17.78,19.05 7.62,8.89 6.35,8.89 BLUETOOTH.RXD | v25.4,88.9 v17.78,81.28
  Bottom 0.254: v17.78,81.28 v17.78,19.05 | v25.4,88.9 25.4,110.49 13.97,121.92 U2.11
BLUETH_TXD  (via drill 0.38)
  Top 0.254: v16.51,16.51 6.35,6.35 BLUETOOTH.TXD
  Bottom 0.254: v16.51,16.51 16.51,90.17 10.16,96.52 10.16,106.68 U2.6
GND  (via drill 0.6, 1.1)
  Top 0.254: 30.48,118.11 30.48,114.3 | 30.48,128.27 30.48,132.08 C30.2 | 30.48,128.27 30.48,118.11 | 30.48,118.11 C28.2 | 30.48,128.27 C29.2 | 2.54,16.51 C32.2 2.54,26.67 5.08,29.21 JP1.1 | 15.24,26.67 v15.4,26.83 | 30.48,114.3 30.48,111.76 34.29,107.95 v33.97,107.79 | 30.48,114.3 C27.2 | BLUETOOTH.GND 22.3,15.93 C31.1 22.86,20.16 JP3.1
  Top 0.305: 41.75,122.87 41.75,117.66 C16.2 | C14.2 59.53,122.84 RS_TRANS_6.GND | RS_TRANS_3.GND 87,118.62 C11.2 | 96.36,122.87 96.36,119.54 94.46,117.63 92.46,117.63 C10.2 | RS_TRANS_5.GND 68.61,119.22 C13.2 | 50.64,122.87 50.64,117.66 C15.2 | RS_TRANS_4.GND 77.47,117.98 C12.2 | v77.47,80.01 74.3,80.01 v71.12,83.19
  Top 0.406: RS_TRANS_4.GND v77.47,124.46 | RS_TRANS_5.GND 68.58,122.87 v68.58,124.46 | RS_TRANS_3.GND v87,124.46 | RS_TRANS_2.GND 96.36,122.87 v96.36,124.46 | RS_TRANS_8.GND 41.75,122.87 v41.75,124.46 | RS_TRANS_7.GND 50.64,122.87 v50.64,124.46 | RS_TRANS_6.GND 59.53,122.87 v59.53,124.46 | C20.2 v63.34,91.28 63.5,91.44 | C19.2 v73.98,91.12 72.87,91.12 71.91,90.17 v71.91,87.15 | C18.2 v84.93,91.12 83.66,91.12 82.71,90.17 v82.71,87.15 | RS_TRANS_12.GND 70.52,83.79 v71.12,83.19 | RS_TRANS_9.GND 59.56,83.47 v59.85,83.19 61.01,82.02 U4_MUX.8 U4_MUX.7 | v123.98,132.24 C21.2 | RS-485-1.GND 119.22,125.1 v119.54,125.41 | RS_TRANS_1.GND 105.28,113.54 v105.09,113.35 102.9,111.15 C9.2 | RS-485-4.GND 118.84,42.8 v119.06,43.02 | RS-485-5.GND 118.75,59.05 v118.9,59.21 | RS-485-6.GND 118.87,75.69 v119.06,75.88 | RS-485-3.GND 118.9,92.08 v119.06,92.23 | RS-485-2.GND 119.06,108.59 v119.22,108.74 | C22.2 v123.82,115.73 | C23.2 v123.82,99.06 | C26.2 v123.35,82.55 | C25.2 123.19,65.88 v123.35,65.72 | C24.2 v123.51,49.69 | U7_MUX.7 v109.06,57.78 | U3_MUX.6 U3_MUX.7 | U3_MUX.7 U3_MUX.8 93.98,75.62 93.98,76.52 91.92,78.58 v91.92,83.19 91.95,83.22 RS_TRANS_10.GND | U3_MUX.7 v92.23,74.3 | U2_MUX.7 U2_MUX.8 77.52,79.96 v77.47,80.01 | U2_MUX.7 U2_MUX.6 | U2_MUX.7 v75.72,74.3 | U4_MUX.7 U4_MUX.6 | U4_MUX.7 v59.05,74.3 | U1_MUX.6 U1_MUX.7 | U1_MUX.7 U1_MUX.8 | U1_MUX.7 v35.08,97.95 | C3.2 34.29,107.95 34.13,107.95 v33.97,107.79 | U5_MUX.8 U5_MUX.7 | U5_MUX.7 U5_MUX.6 | U5_MUX.7 v109.7,88.27 | C6.2 v108.27,98.58 | v93.66,64.29 C7.2 | v107.79,67.47 109.57,67.47 C8.2 | v60.64,64.45 C4.2 58.58,64.42 58.58,63.02 57.78,62.23 v55.88,62.23 56.52,61.59 U$2.GND2
  Top 0.406: C5.2 76.84,64.45 v76.99,64.29 | v50.01,90.01 51.56,90.01 C17.2 | RS_TRANS_11.GND 82.23,84.77 v82.39,84.61 | v106.68,127 v113.03,127 | 103.21,40.51 v103.19,40.48 | v97.63,70.01 101.44,70.01 v101.6,69.85 | v95.41,49.05 96.04,49.05 | 99.22,50.8 v99.38,50.64
  Top 0.61: U7_MUX.6 U7_MUX.7 U7_MUX.8
  Top 0.813: v123.19,16.51 v120.65,13.97
  Top 1.016: D1.C v15.4,26.83 | C1.2 v112.08,53.5 | C2.2 v112.08,41.75 | v28.26,134.46 32.23,134.46 33.97,132.72 v33.97,127.64 | 96.04,49.05 97.79,50.8 99.22,50.8 | v35.24,20.95 v35.24,16.99
  Top 1.27: U$1.GND 103.21,40.51
  Bottom 0.406: v82.39,84.61 82.39,86.84 v82.71,87.15
  pour Bottom (isolate 0.305): 0,135.89 0,0 146.05,0 146.05,135.89
GPS_RX
  Bottom 0.254: U2.4 22.86,93.98 22.86,77.47 GPS.6
GPS_TX
  Bottom 0.254: U2.5 24.13,95.25 24.13,78.74 GPS.5
LCD_D4  (via drill 0.6)
  Top 0.406: JP3.7 v31.75,35.88 | v64.77,16.51 66.04,15.24 66.04,13.97 68.58,11.43 v72.23,11.43
  Bottom 0.406: v31.75,35.88 31.75,33.02 41.91,22.86 58.42,22.86 v64.77,16.51 | v72.23,11.43 76.36,11.43 U$2.PF1
LCD_D5  (via drill 0.38)
  Top 0.254: v43.18,19.05 v43.18,46.99
  Bottom 0.254: v43.18,46.99 50.8,46.99 53.34,49.53 55.88,49.53 U$2.PF2 | v43.18,19.05 20.32,19.05 19.05,20.32 19.05,35.56 21.59,38.1 JP3.8
LCD_D6  (via drill 0.38)
  Top 0.254: JP3.9 22.86,40.64 33.02,40.64 41.43,49.05 44.29,49.05 45.72,47.62 v45.72,45.72
  Bottom 0.254: v45.72,45.72 55.88,45.72 58.42,48.26 58.42,49.53 U$2.PF3
LCD_D7  (via drill 0.38)
  Top 0.254: v81.28,54.61 81.28,50.8 80.01,49.53 U$2.PF4 | v30.48,50.8 v39.37,50.8 | v26.67,46.99 22.86,43.18 JP3.10
  Bottom 0.254: v81.28,54.61 43.18,54.61 v39.37,50.8 | v26.67,46.99 v30.48,50.8
LCD_EN  (via drill 0.6)
  Top 0.406: JP3.6 v40.32,33.34 | v59.69,43.18 60.96,43.18 62.55,44.77 62.55,47.31 62.87,47.62 62.87,50.32 U$2.PF0
  Bottom 0.406: v40.32,33.34 49.85,33.34 v59.69,43.18
LCD_RS  (via drill 0.38, 0.6)
  Top 0.254: v63.5,13.97 68.58,8.89 U$2.PD3
  Top 0.406: JP3.4 31.43,28.26 v33.02,26.67
  Bottom 0.254: 62.23,15.24 v63.5,13.97
  Bottom 0.406: v33.02,26.67 39.37,20.32 57.15,20.32 62.23,15.24
LCD_RW
  Top 0.406: U$10.P$1 45.72,54.61 40.64,49.53 23.34,49.53 JP3.12
  Bottom 0.406: JP3.5 25.08,30.8 25.72,31.43 25.72,46.35 23.65,48.42 22.54,48.42 JP3.12
N$1
  Top 0.61: RS-485-1.A 123.82,128.91 127,132.08 127.38,132.08 R26.1 129.16,133.35 137.16,133.35 138.43,132.08 138.43,124.46 136.53,122.56 U$4.1
N$2  (via drill 0.6)
  Top 0.61: RS-485-1.B 126.24,127.64 R26.2 128.78,129.03 v129.54,128.27
  Bottom 0.61: v129.54,128.27 129.54,127.64 U$4.2
N$3
  Top 0.406: S1.3 45.42,68.4 47.47,66.36 47.47,14.61 45.08,12.22 45.08,9.05 45.72,8.41 U$2.VBUS
N$4
  Top 0.305: R27.1 129.16,122.81 131.44,125.1 U$4.3
  Top 0.61: RS-485-1.Y 123.82,125.1 125.73,123.19 127.25,123.19 R27.1
N$7
  Top 0.406: U$10.P$2 43.18,54.61 40.64,52.07 21.91,52.07 19.21,49.37 19.21,26.67 20.16,25.72 JP3.3
N$8
  Top 0.61: RS-485-2.Z 126.88,109.86 R29.2 127.76,109.22 130.18,109.22 U$5.6
N$9
  Top 0.61: RS-485-1.Z 126.88,126.37 R27.2 130.05,125.61 U$4.6
N$10
  Top 0.61: RS-485-2.A 123.82,112.4 127,115.57 127.38,115.57 R28.1 128.02,115.32 129.54,116.84 137.16,116.84 138.43,115.57 138.43,107.95 136.53,106.05 U$5.1
N$11  (via drill 0.6)
  Top 0.61: RS-485-2.B 126.24,111.12 R28.2 128.78,112.52 v129.54,111.76
  Bottom 0.61: v129.54,111.76 129.54,111.12 U$5.2
N$12
  Top 0.305: U$5.3 131.44,108.59 129.16,106.3 R29.1
  Top 0.61: RS-485-2.Y 123.82,108.59 125.73,106.68 127.25,106.68 R29.1
N$13
  Top 0.61: RS-485-3.Z 126.24,93.35 R31.2 129.42,91.95 U$6.6
N$14
  Top 0.61: RS-485-3.A 123.82,95.89 127,99.06 127.38,99.06 R30.1 128.02,98.81 129.54,100.33 137.16,100.33 138.43,99.06 138.43,91.44 136.53,89.54 U$6.1
N$15  (via drill 0.6)
  Top 0.61: RS-485-3.B 126.24,94.62 R30.2 128.78,96.01 v129.54,95.25
  Bottom 0.61: v129.54,95.25 129.54,94.62 U$6.2
N$16
  Top 0.305: U$6.3 131.44,92.08 128.27,88.9 127.89,88.9 R31.1
  Top 0.61: RS-485-3.Y 123.82,92.08 126.75,89.15 R31.1
N$17
  Top 0.61: RS-485-4.Z 125.99,44.07 R33.2 129.42,42.42 U$7.6
N$18
  Top 0.61: RS-485-4.A 124.08,46.61 127,49.53 127.38,49.53 R32.1 128.02,49.28 129.54,50.8 137.16,50.8 138.43,49.53 138.43,41.91 136.53,40.01 U$7.1
N$19  (via drill 0.6)
  Top 0.61: RS-485-4.B 126.5,45.34 R32.2 128.78,46.48 v129.54,45.72
  Bottom 0.61: v129.54,45.72 129.54,45.09 U$7.2
N$20
  Top 0.305: R33.1 128.52,39.62 131.44,42.55 U$7.3
  Top 0.61: RS-485-4.Y 123.57,42.8 127,39.37 127.38,39.37 R33.1
N$21
  Top 0.61: RS-485-5.Z 126.11,60.32 R35.2 129.42,58.93 U$8.6
N$22
  Top 0.61: RS-485-5.A 123.82,62.87 127,66.04 R34.1 128.27,66.04 129.54,67.31 137.16,67.31 138.43,66.04 138.43,58.42 136.53,56.52 U$8.1
N$28  (via drill 0.6)
  Top 0.61: RS-485-5.B 125.73,61.59 R34.2 128.53,63.24 v129.54,62.23
  Bottom 0.61: v129.54,62.23 129.54,61.59 U$8.2
N$29
  Top 0.305: R35.1 128.52,56.13 131.44,59.05 U$8.3
  Top 0.61: RS-485-5.Y 123.82,59.05 127,55.88 127.26,55.88 R35.1
N$33
  Top 0.61: RS-485-6.Z 125.73,76.96 R37.2 129.03,75.06 U$9.6
N$34
  Top 0.61: RS-485-6.A 123.95,79.5 127,82.55 127.5,82.55 R36.1 128.4,82.68 129.54,83.82 135.89,83.82 138.43,81.28 138.43,74.93 136.53,73.03 U$9.1
N$35  (via drill 0.6)
  Top 0.61: RS-485-6.B 125.99,78.23 R36.2 128.4,79.88 v129.54,78.74
  Bottom 0.61: v129.54,78.74 129.54,78.11 U$9.2
N$36
  Top 0.305: R37.1 128.14,72.26 131.44,75.57 U$9.3
  Top 0.61: RS-485-6.Y 123.7,75.69 127,72.39 127.5,72.39 R37.1
N$45
  Top 1.016: D1.A 11.69,32.77 R1.2
N$58
  Top 0.254: 5.08,12.7 3.81,12.7 2.54,13.97 C32.1 | 5.08,12.7 6.35,12.7 BLUETOOTH.RESET | 5.08,12.7 2.54,10.16 R39.2
RESET  (via drill 0.38)
  Top 0.254: U2.1 16.51,96.52 | 16.51,96.52 R38.1 19.05,96.52 | 16.51,96.52 v20.32,100.33
  Bottom 0.254: J1.5 21.59,109.22 21.59,101.6 v20.32,100.33 | U2.1 21.59,87.63 21.59,67.31 44.45,44.45 66.04,44.45
  Bottom 0.406: U$2.RST 66.67,51.28 65.41,50.01 65.41,45.09 66.04,44.45 97.79,12.7 97.79,7.62 100.65,4.76 126.92,4.76 U1.22
RS485_1_RX  (via drill 0.6)
  Top 0.406: RS_TRANS_1.RO 106.23,111 v105.09,109.86 | v41.27,93.82 41.27,99.54 40.32,100.49 U1_MUX.12
  Bottom 0.406: v105.09,109.86 103.5,109.86 95.25,101.6 95.25,93.98 89.53,88.27 46.83,88.27 v41.27,93.82
RS485_1_TX  (via drill 0.6)
  Top 0.406: RS_TRANS_1.DI 105.6,112.27 v104.78,111.44 | v31.11,105.57 U1_MUX.1
  Bottom 0.406: v104.78,111.44 103.82,111.44 93.98,101.6 93.98,93.98 88.9,88.9 48.26,88.9 41.91,95.25 31.75,95.25 30.48,96.52 30.48,104.93 v31.11,105.57
RS485_2_RX  (via drill 0.6)
  Top 0.305: RS_TRANS_2.RO 93.85,121.89 v94.46,121.29
  Top 0.406: v74.14,71.76 U2_MUX.12
  Bottom 0.406: v94.46,121.29 94.46,130.49 95.57,131.6 106.36,131.6 108.9,129.06 108.9,105.89 96.68,93.66 96.68,76.52 95.73,75.57 74.93,75.57 74.14,74.77 v74.14,71.76
RS485_2_TX  (via drill 0.6)
  Top 0.305: RS_TRANS_2.DI 95.12,122.37 95.73,121.76 95.73,120.65 v94.77,119.7
  Top 0.406: v75.41,66.68 U2_MUX.1
  Bottom 0.406: v94.77,119.7 95.57,120.49 95.57,122.87 95.25,123.19 95.25,130.02 96.04,130.81 106.2,130.81 108.27,128.75 108.27,106.2 96.04,93.98 96.04,77.15 95.41,76.52 74.93,76.52 73.03,74.61 73.03,69.06 v75.41,66.68
RS485_3_RX  (via drill 0.6)
  Top 0.305: RS_TRANS_3.RO 84.45,121.13 v84.14,120.81
  Top 0.406: v90.49,71.76 U3_MUX.12
  Bottom 0.406: v84.14,120.81 84.14,132.24 85.09,133.19 107,133.19 110.33,129.86 110.33,105.41 97.95,93.03 97.95,72.71 97,71.76 v90.49,71.76
RS485_3_TX  (via drill 0.6)
  Top 0.305: RS_TRANS_3.DI 85.72,120.97 v85.88,120.81
  Top 0.406: U3_MUX.1 95.73,66.68 96.68,67.63 v96.68,73.5
  Bottom 0.406: v85.88,120.81 85.88,131.76 86.52,132.4 106.68,132.4 109.7,129.38 109.7,105.73 97.31,93.35 97.31,74.14 v96.68,73.5
RS485_4_RX  (via drill 0.6)
  Top 0.305: RS_TRANS_4.RO 74.93,120.81 v74.77,120.65
  Top 0.406: v57.47,71.76 U4_MUX.12
  Bottom 0.406: v74.77,120.65 74.77,133.19 76.2,134.62 107.95,134.62 111.76,130.81 111.76,104.93 99.22,92.39 99.22,66.2 93.98,60.96 58.42,60.96 57.15,62.23 57.15,71.44 v57.47,71.76
RS485_4_TX  (via drill 0.6)
  Top 0.305: RS_TRANS_4.DI v76.2,120.65
  Top 0.406: v62.87,66.68 U4_MUX.1
  Bottom 0.406: v76.2,120.65 76.2,132.56 77.47,133.83 107.47,133.83 111.12,130.18 111.12,105.25 98.58,92.71 98.58,66.52 93.66,61.59 64.77,61.59 62.87,63.5 v62.87,66.68
RS485_5_RX  (via drill 0.6)
  Top 0.305: RS_TRANS_5.RO 66.07,121.63 v65.72,121.29
  Top 0.406: v53.34,69.22 U4_MUX.14
  Bottom 0.406: v65.72,121.29 65.72,131.13 62.23,134.62 31.59,134.62 26.19,129.22 26.19,91.28 48.26,69.22 v53.34,69.22
RS485_5_TX  (via drill 0.6)
  Top 0.305: RS_TRANS_5.DI 67.34,121 66.2,119.86 65.88,119.86 v65.72,119.7
  Top 0.406: v59.21,71.76 U4_MUX.5
  Bottom 0.406: v65.72,119.7 65.41,119.7 64.77,120.33 64.77,130.81 61.91,133.67 31.91,133.67 26.83,128.59 26.83,91.6 45.24,73.18 58.26,73.18 59.21,72.23 v59.21,71.76
RS485_6_RX  (via drill 0.6)
  Top 0.305: RS_TRANS_6.RO 57.02,121.63 v56.67,121.29
  Top 0.406: v87,69.22 U3_MUX.14
  Bottom 0.406: v56.67,121.29 56.67,130.33 54.45,132.56 31.75,132.56 27.46,128.27 27.46,92.08 43.02,76.52 62.23,76.52 64.29,74.45 64.29,63.34 65.25,62.39 86.52,62.39 87,62.87 v87,69.22
RS485_6_TX  (via drill 0.6)
  Top 0.305: RS_TRANS_6.DI 58.29,121.79 57.94,121.44 57.94,120.17 57.47,119.7
  Top 0.406: 57.47,119.7 v56.67,119.7 | v94.77,77.95 95.57,77.15 95.57,72.55 94.77,71.76 U3_MUX.5
  Bottom 0.406: v56.67,119.7 56.36,119.7 55.72,120.33 55.72,130.02 53.97,131.76 32.23,131.76 28.1,127.64 28.1,92.55 43.34,77.31 94.14,77.31 v94.77,77.95
RS485_7_RX  (via drill 0.6)
  Top 0.305: RS_TRANS_7.RO 48.13,121.32 v48.1,121.29
  Top 0.406: U2_MUX.14 69.22,69.22 68.58,69.85 v68.58,79.38
  Bottom 0.406: v48.1,121.29 48.1,128.43 46.67,129.86 33.02,129.86 29.37,126.21 29.37,93.5 44.29,78.58 67.79,78.58 v68.58,79.38
RS485_7_TX  (via drill 0.6)
  Top 0.305: RS_TRANS_7.DI 49.4,121.32 v49.37,121.29
  Top 0.406: v79.38,78.74 79.38,72.23 78.9,71.76 U2_MUX.5
  Bottom 0.406: v49.37,121.29 49.37,129.7 48.26,130.81 32.7,130.81 28.73,126.84 28.73,93.03 43.81,77.95 78.58,77.95 v79.38,78.74
RS485_8_RX  (via drill 0.6)
  Top 0.305: RS_TRANS_8.RO 39.24,121.16 v39.05,120.97
  Top 0.406: U1_MUX.14 v36.67,103.03
  Bottom 0.406: v39.05,120.97 39.05,117.79 36.83,115.57 36.83,103.19 v36.67,103.03
RS485_8_TX  (via drill 0.6)
  Top 0.305: RS_TRANS_8.DI 40.51,121.1 v40.64,120.97
  Top 0.406: v35.4,100.49 U1_MUX.5
  Bottom 0.406: v40.64,120.97 40.64,121.6 39.85,122.4 38.58,122.4 37.62,121.44 37.62,117.95 35.56,115.89 35.56,100.65 v35.4,100.49
RS485_9_RX
  Top 0.406: RS_TRANS_9.RO 57.02,85.06 54.29,87.79 54.29,90.01 53.34,90.96 50.01,90.96 43.5,97.47 43.5,103.66 42.86,104.3 U1_MUX.15
RS485_9_TX
  Top 0.406: RS_TRANS_9.DI 58.29,85.54 55.09,88.74 55.09,90.49 53.97,91.6 50.32,91.6 44.29,97.63 44.29,103.82 43.18,104.93 35.4,104.93 34.77,104.3 U1_MUX.2
RS485_10_RX  (via drill 0.6)
  Top 0.406: RS_TRANS_10.RO 89.41,81.79 v87.63,80.01 | v82.55,80.01 82.55,71.12 80.01,68.58 74.45,68.58 73.82,67.95 U2_MUX.15
  Bottom 0.406: v87.63,80.01 v82.55,80.01
RS485_10_TX  (via drill 0.6)
  Top 0.406: RS_TRANS_10.DI 90.68,80.52 88.74,78.58 v87.63,78.58 | v83.82,78.58 83.82,71.44 80.33,67.95 U2_MUX.2
  Bottom 0.406: v87.63,78.58 v83.82,78.58
RS485_11_RX
  Top 0.406: RS_TRANS_11.RO 78.61,83.95 80.01,82.55 83.98,82.55 85.09,81.44 85.09,69.22 86.36,67.95 U3_MUX.15
RS485_11_TX
  Top 0.406: RS_TRANS_11.DI 79.88,83.79 80.49,83.19 84.3,83.19 85.88,81.6 85.88,78.11 87.15,76.84 89.85,76.84 90.81,75.88 90.81,73.82 92.07,72.55 92.07,68.58 92.71,67.95 U3_MUX.2
RS485_12_RX
  Top 0.406: RS_TRANS_12.RO 67.98,81.63 62.39,76.04 62.39,70.17 62.07,69.85 59.05,69.85 57.15,67.95 U4_MUX.15
RS485_12_TX
  Top 0.406: U4_MUX.2 62.07,67.95 63.18,69.06 63.18,75.72 69.25,81.79 RS_TRANS_12.DI
RS485_13_RX  (via drill 0.6)
  Top 0.406: U5_MUX.12 116.68,90.81 v117.95,89.54 | v119.54,127.64 RS-485-1.RO
  Bottom 0.406: v117.95,89.54 119.7,89.54 120.97,90.81 120.97,126.21 v119.54,127.64
RS485_13_TX
  Top 0.406: U5_MUX.1 107.9,96.57 107.31,97.31 107.31,99.54 114.3,106.68 114.3,125.1 115.57,126.37 RS-485-1.DI
RS485_14_RX  (via drill 0.6)
  Top 0.406: U5_MUX.14 111.6,93.35 111.12,93.82 v111.12,96.2 | v116.05,111.12 RS-485-2.RO
  Bottom 0.406: v111.12,96.2 111.12,96.36 114.3,99.7 114.3,110.17 115.25,111.12 v116.05,111.12
RS485_14_TX  (via drill 0.6)
  Top 0.406: U5_MUX.5 v109.54,90.81 | v115.57,109.22 115.73,109.22 116.36,109.86 RS-485-2.DI
  Bottom 0.406: v109.54,90.81 109.54,92.23 115.57,98.27 v115.57,109.22
RS485_15_RX
  Top 0.406: RS-485-3.RO U5_MUX.15
RS485_15_TX
  Top 0.406: U5_MUX.2 109.06,94.62 110.97,92.71 115.73,92.71 116.36,93.35 RS-485-3.DI
RS485_16_RX
  Top 0.406: U7_MUX.12 113.66,60.32 114.46,59.53 114.46,46.83 115.89,45.4 117.35,45.4 RS-485-4.RO
RS485_16_TX  (via drill 0.6)
  Top 0.406: U7_MUX.1 109.54,65.41 v110.65,64.29 | RS-485-4.DI 115.66,44.07 v115.57,43.97
  Bottom 0.406: v110.65,64.29 112.4,62.55 117.79,62.55 120.65,59.69 120.65,55.88 115.57,50.8 v115.57,43.97
RS485_17_RX
  Top 0.406: U7_MUX.14 114.78,62.87 116.05,61.59 RS-485-5.RO
RS485_17_TX
  Top 0.406: U7_MUX.5 109.7,60.32 110.33,60.96 114.78,60.96 115.41,60.32 RS-485-5.DI
RS485_18_RX  (via drill 0.6)
  Top 0.406: U7_MUX.15 v114.78,64.14 | v114.78,78.26 117.13,78.26 RS-485-6.RO
  Bottom 0.406: v114.78,64.14 v114.78,78.26
RS485_18_TX  (via drill 0.6)
  Top 0.406: RS-485-6.DI 115.22,76.96 v109.85,71.6 | v108.9,64.14 U7_MUX.2
  Bottom 0.406: v109.85,71.6 108.9,70.64 v108.9,64.14
TCP_INT  (via drill 0.6)
  Top 0.254: 97.79,2.54 118.11,2.54 121.92,6.35 U1.28 121.92,7.62
  Top 0.305: 97.79,2.54 v69.85,2.54
  Bottom 0.305: U$2.PD2 66.67,8.25 65.41,6.99 65.41,5.08 67.94,2.54 v69.85,2.54
TCP_MISO  (via drill 0.6)
  Top 0.406: v96.52,20.32 122.56,20.32 U1.2
  Bottom 0.406: U$2.PA4 75.56,50.32 75.56,47.62 89.53,33.66 89.53,27.3 v96.52,20.32
TCP_MOSI
  Bottom 0.406: U$2.PA5 74.3,5.71 76.2,3.81 133.35,3.81 135.89,6.35 135.89,23.49 U1.1
TCP_SCLK
  Bottom 0.406: U$2.PA2 79.38,51.44 92.71,38.1 92.71,31.75 106.68,17.78 119.15,17.78 U1.23
TCP_SS
  Bottom 0.406: U$2.PA3 76.84,51.28 78.1,50.01 78.1,46.35 90.17,34.29 90.17,34.13 91.6,32.7 91.6,30.96 101.6,21.11 101.6,14.92 104.62,11.91 104.62,6.03 105.09,5.56 125.17,5.56 U1.24
TMP_AL
  Bottom 0.254: U2.26 2.54,99.06 2.54,55.88 12.7,45.72 JP2.4
TMP_SCL  (via drill 0.38)
  Top 0.254: v5.08,48.26 U2.28
  Bottom 0.254: v5.08,48.26 12.7,40.64 JP2.2
TMP_SDA  (via drill 0.38)
  Top 0.254: U2.27 8.89,95.25 v8.89,41.91
  Bottom 0.254: v8.89,41.91 12.7,38.1 JP2.1
U1_MUX_S0  (via drill 0.6)
  Top 0.406: U1_MUX.10 39.05,97.95 39.85,97.16 39.85,93.19 48.26,84.61 49.37,83.5 49.37,13.65 v49.85,13.18 | v54.93,11.27 56.04,11.27 57.78,9.53 57.78,7.78 58.42,7.14 59.69,7.14 60.32,6.51 60.32,4.92 60.64,4.6 75.56,4.6 U$2.PA6
  Bottom 0.406: v49.85,13.18 54.13,13.18 54.77,12.54 54.77,11.43 v54.93,11.27
U1_MUX_S1  (via drill 0.6)
  Top 0.406: U1_MUX.9 38.31,93.29 47.31,84.14 48.74,82.71 48.74,12.22 v50.8,10.16 | v51.44,6.67 54.29,3.81 77.31,3.81 U$2.PA7
  Bottom 0.406: v50.8,10.16 50.8,7.3 v51.44,6.67
U1RX  (via drill 0.6)
  Top 0.406: U1_MUX.13 40.8,101.76 42.39,100.17 42.39,92.23 49.37,85.09 50.01,84.46 50.01,16.19 v51.12,15.08
  Bottom 0.406: v51.12,15.08 54.13,15.08 57.78,11.43 57.78,7.78 58.42,7.14 60.32,7.14 U$2.PB0
U1TX  (via drill 0.6)
  Top 0.406: U1_MUX.3 32.07,103.03 31.43,102.39 31.43,96.04 32.7,94.77 35.72,94.77 48.1,82.39 v48.1,10.16
  Bottom 0.406: v48.1,10.16 48.1,7.78 52.07,3.81 63.5,3.81 64.13,4.45 U$2.PB1
U2_MUX_S0  (via drill 0.6)
  Top 0.406: U2_MUX.10 70.33,74.3 v69.69,73.66 | v67.94,63.98 67.94,59.37 70.48,56.83 v70.48,37.15 | U$2.PE2 76.04,10.16 76.04,13.81 v76.99,14.76
  Bottom 0.406: v69.69,73.66 68.74,73.66 67.94,72.87 v67.94,63.98 | v76.99,14.76 79.85,17.62 79.85,29.21 71.91,37.15 v70.48,37.15
U2_MUX_S1  (via drill 0.6)
  Top 0.406: U2_MUX.9 v69.69,75.57 | v65.88,63.98 65.88,59.05 67.94,56.99 v67.94,37.31 | U$2.PE3 76.84,12.07 78.1,13.34 v78.1,28.57
  Bottom 0.406: v69.69,75.57 68.1,75.57 65.88,73.34 v65.88,63.98 | v67.94,37.31 67.94,36.83 70.01,34.77 71.91,34.77 v78.1,28.57
U2RX  (via drill 0.6)
  Top 0.406: U2_MUX.13 v69.85,70.48 | v69.85,63.98 69.85,59.37 73.03,56.2 73.03,50.32 U$2.PD6
  Bottom 0.406: v69.85,70.48 v69.85,63.98
U2TX  (via drill 0.6)
  Top 0.406: U2_MUX.3 78.58,69.22 v80.01,70.64 | v78.58,64.29 78.58,53.34 78.1,52.86 78.1,50.32 U$2.PD7
  Bottom 0.406: v80.01,70.64 80.01,70.48 79.06,69.53 79.06,64.77 v78.58,64.29
U3_MUX_S0  (via drill 0.6)
  Top 0.406: U3_MUX.10 88.27,74.3 v86.36,72.39 | v81.76,64.29 v81.76,58.42 | v59.05,58.42 U$2.PB2
  Bottom 0.406: v86.36,72.39 84.3,70.33 84.3,67.47 81.76,64.93 v81.76,64.29 | v81.76,58.42 v59.05,58.42
U3_MUX_S1  (via drill 0.6)
  Top 0.406: U3_MUX.9 87.79,75.57 v86.36,74.14 | v80.17,64.29 v80.17,59.69 | v53.34,59.69 53.34,46.99 54.61,45.72 58.26,45.72 U$2.PB3
  Bottom 0.406: v86.36,74.14 83.34,71.12 83.34,67.47 v80.17,64.29 | v80.17,59.69 v53.34,59.69
U3RX  (via drill 0.6)
  Top 0.406: U3_MUX.13 86.68,70.48 v86.36,70.8 | v83.19,64.29 83.19,50.16 80.01,46.99 72.23,46.99 v71.75,46.51
  Bottom 0.406: v86.36,70.8 85.09,69.53 85.09,66.2 v83.19,64.29 | v71.75,46.51 69.69,46.51 69.22,46.99 U$2.PC6
U3TX  (via drill 0.6)
  Top 0.406: U3_MUX.3 v95.57,69.22 | v95.25,65.41 95.25,61.28 78.9,44.93 v73.34,44.93
  Bottom 0.406: v95.57,69.22 95.57,65.72 v95.25,65.41 | U$2.PC7 71.75,48.74 73.34,47.15 v73.34,44.93
U4_MUX_S0
  Top 0.406: U4_MUX.10 54.45,74.3 51.44,71.28 51.44,18.73 52.7,17.46 54.93,17.46 62.87,9.53 62.87,7.62 63.34,7.14 70.48,7.14 U$2.PB4
U4_MUX_S1  (via drill 0.6)
  Top 0.406: U4_MUX.9 54.61,75.57 50.8,71.76 50.8,17.62 52.7,15.72 v52.7,10.16
  Bottom 0.406: U$2.PB5 59.05,5.4 58.26,4.6 54.61,4.6 53.66,5.56 53.66,9.21 v52.7,10.16
U4RX
  Top 0.406: U4_MUX.13 52.86,70.48 52.07,69.69 52.07,43.18 53.34,41.91 62.23,41.91 64.13,43.81 U$2.PC4
U4TX  (via drill 0.6)
  Top 0.406: U4_MUX.3 60.48,69.22 v59.05,67.79 | v60.64,62.23 60.64,59.05 65.41,54.29 65.41,50.32 U$2.PC5
  Bottom 0.406: v59.05,67.79 59.05,63.82 v60.64,62.23
U5_MUX_S0  (via drill 0.6)
  Top 0.406: U5_MUX.10 116.21,88.27 116.84,87.63 116.84,85.09 113.03,81.28 113.03,77.47 105.41,69.85 105.41,64.61 102.08,61.28 102.08,58.9 v101.6,58.42 | v94.93,58.42 94.62,58.42 76.99,40.8 v76.2,40.8
  Bottom 0.406: v101.6,58.42 v94.93,58.42 | U$2.PB6 71.75,51.12 73.03,49.85 73.03,48.42 76.2,45.24 v76.2,40.8
U5_MUX_S1  (via drill 0.6)
  Top 0.406: U5_MUX.9 114.94,87 115.57,86.36 115.57,85.09 112.24,81.76 112.24,77.63 104.62,70.01 104.62,64.77 100.49,60.64 v100.49,59.85 | v95.88,59.85 94.77,59.85 77.63,42.7 v71.91,42.7
  Bottom 0.406: v100.49,59.85 v95.88,59.85 | U$2.PB7 69.22,50.96 67.94,49.69 67.94,46.67 v71.91,42.7
U5RX  (via drill 0.6)
  Top 0.305: 103.98,65.09 73.34,34.45
  Top 0.406: U5_MUX.13 111.76,92.08 111.28,91.6 111.28,77.63 103.98,70.33 103.98,65.09 | 73.34,34.45 73.34,14.61 72.07,13.34 v68.58,13.34
  Bottom 0.406: U$2.PE4 67.94,7.14 67.94,12.7 v68.58,13.34
U5TX  (via drill 0.6)
  Top 0.305: 103.35,65.25 72.71,34.77
  Top 0.406: 72.71,34.77 72.71,17.14 v70.48,14.92 | 103.35,65.25 103.35,70.64 104.62,71.91 104.62,92.23 105.73,93.35 U5_MUX.3
  Bottom 0.406: U$2.PE5 70.48,7.14 v70.48,14.92
U7_MUX_S0  (via drill 0.6)
  Top 0.406: U7_MUX.10 111.12,57.78 107.95,54.61 96.84,54.61 75.09,32.86 v75.09,27.78
  Bottom 0.406: U$2.PD0 61.59,10.64 75.09,24.13 v75.09,27.78
U7_MUX_S1  (via drill 0.6)
  Top 0.406: U7_MUX.9 110.81,56.52 106.68,52.39 95.73,52.39 76.04,32.7 76.04,27.46 v76.68,26.83
  Bottom 0.406: U$2.PD1 64.13,10.8 76.68,23.34 v76.68,26.83
U7RX  (via drill 0.6)
  Top 0.406: U7_MUX.13 109.22,61.59 108.59,62.23 105.09,62.23 103.98,61.12 v103.98,58.58 | v60.48,57.15 60.48,52.7 U$2.PE0
  Bottom 0.406: v103.98,58.58 103.98,58.26 102.87,57.15 v60.48,57.15
U7TX
  Top 0.406: U7_MUX.3 104.78,62.87 102.87,60.96 102.87,56.99 101.6,55.72 97,55.72 74.14,32.86 74.14,11.43 71.75,9.05 U$2.PE1

## Text on the board
tPlace: 8 | 5 | 4 | 3 | 2 | 7 | 6 | 13 | 1 | 6 | 5 | 9 | 8 | 7 | 4 | 3 | 2 | 1 | 14 | 10 | 12 | 11 | 9 | 9 | 12 | 11 | 10 | 15 | 18 | 17 | 16 | MRDT | Missouri S&T | Motherboard V1.0